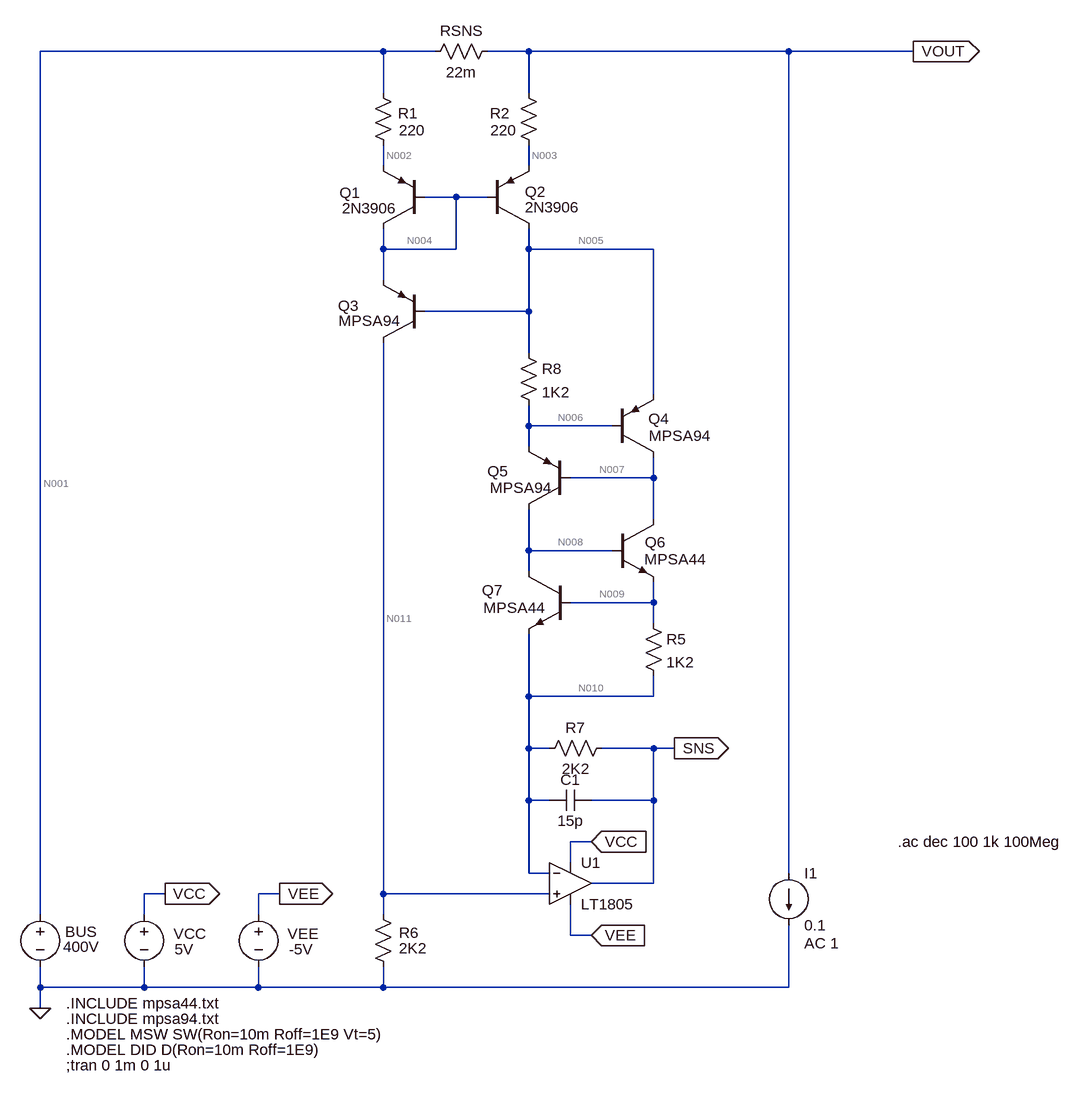
[diagram p0: schematic isense01_neg_rail_AC.asc]
* isense01_neg_rail_AC.asc
RSNS VOUT N001 22m
R1 N001 N002 220
R2 VOUT N003 220
Q1 N004 N004 N002 0 2N3906
Q2 N005 N004 N003 0 2N3906
R6 N011 0 2K2
R7 SNS N010 2K2
V§BUS N001 0 400V
Q7 N008 N009 N010 0 MPSA44
R8 N005 N006 1K2
R5 N009 N010 1K2
Q3 N011 N005 N004 0 MPSA94
VCC VCC 0 5V
C1 SNS N010 15p
Q5 N008 N007 N006 0 MPSA94
Q4 N007 N006 N005 0 MPSA94
Q6 N007 N008 N009 0 MPSA44
I1 VOUT 0 0.1 AC 1
VEE VEE 0 -5V
* U1: LT1805 (symbol Opamps\LT1805 not available, pins judged from their places): In+=N011 In-=N010 V+=VCC V-=VEE OUT=SNS
.model NPN NPN
.model PNP PNP
.lib standard.bjt
.MODEL MSW SW(Ron=10m Roff=1E9 Vt=5)
.MODEL DID D(Ron=10m Roff=1E9)
;tran 0 1m 0 1u
.INCLUDE mpsa44.txt
.INCLUDE mpsa94.txt
.ac dec 100 1k 100Meg
.backanno
.end

* Results of the author's LTspice run, read from the files saved beside the schematic
* Operating Point, zero values left out:
*   V(vout) = 400 V
*   V(n001) = 400 V
*   V(n002) = 399.8 V
*   V(n003) = 399.8 V
*   V(n004) = 399.1 V
*   V(n005) = 398.6 V
*   V(n011) = 2.194 V
*   V(sns) = 40.36 mV
*   V(n010) = 2.194 V
*   V(n008) = 3.306 V
*   V(n009) = 2.788 V
*   V(n006) = 398.1 V
*   V(vcc) = 5 V
*   V(n007) = 397.6 V
*   V(vee) = -5 V
*   Ic(Q4) = -501.4 µA
*   Ib(Q4) = -6.139 µA
*   Ie(Q4) = 507.6 µA
*   Ic(Q5) = -477.6 µA
*   Ib(Q5) = 265.3 nA
*   Ie(Q5) = 477.4 µA
*   Ic(Q3) = -997.1 µA
*   Ib(Q3) = 37.61 nA
*   Ie(Q3) = 997.1 µA
*   Ic(Q6) = 501.2 µA
*   Ib(Q6) = 354.4 nA
*   Ie(Q6) = -501.5 µA
*   Ic(Q7) = 477.3 µA
*   Ib(Q7) = 6.505 µA
*   Ie(Q7) = -483.8 µA
*   Ic(Q2) = -978.8 µA
*   Ib(Q2) = -4.882 µA
*   Ie(Q2) = 983.7 µA
*   Ic(Q1) = -987.3 µA
*   Ib(Q1) = -4.948 µA
*   Ie(Q1) = 992.2 µA
*   I(I1) = 100 mA
*   I(R5) = 495 µA
*   I(R8) = 471.2 µA
*   I(R7) = -978.9 µA
*   I(R6) = 997.2 µA
*   I(R2) = 983.7 µA
*   I(R1) = 992.2 µA
*   I(Rsns) = -101 mA
*   I(Vee) = 3.006 mA
*   I(Vcc) = -2.027 mA
*   I(Bus) = -102 mA
*   Ix(u1:1) = -124.7 nA
*   Ix(u1:2) = -124.7 nA
*   Ix(u1:3) = 978.9 µA
*   Ix(u1:4) = 2.027 mA
*   Ix(u1:5) = -3.006 mA
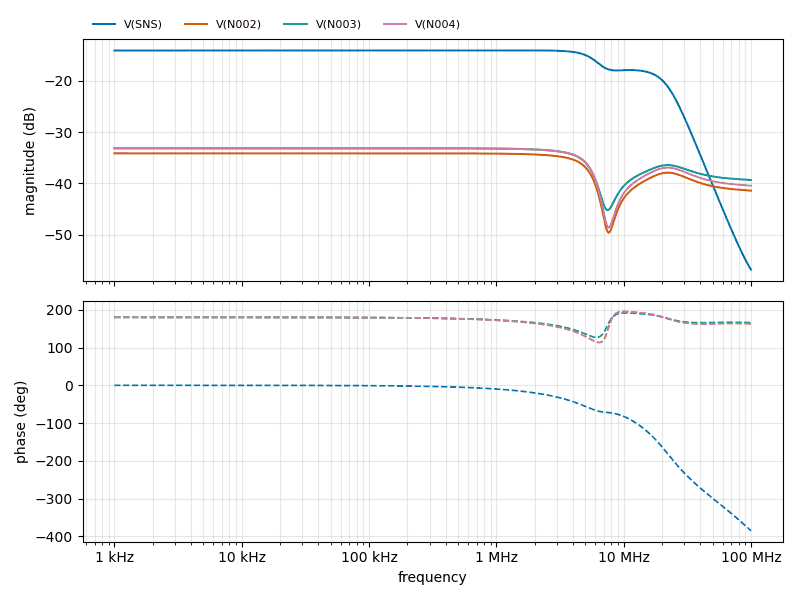
[diagram p1: AC Analysis of isense01_neg_rail_AC.asc, plotted from the saved traces]
* AC Analysis, 1 run:
*   V(SNS): -14.14 dB at 1 kHz, -56.77 dB at 100 MHz, peak -14.12 dB at 1.778 MHz, 3 dB below the peak at 6.73 MHz
*   V(N002): -34.14 dB at 1 kHz, -41.39 dB at 100 MHz, peak -34.14 dB at 1 kHz, 3 dB below the peak at 5.128 MHz
*   V(N003): -33.15 dB at 1 kHz, -39.32 dB at 100 MHz, peak -33.15 dB at 1 kHz, 3 dB below the peak at 5.102 MHz
*   V(N004): -33.16 dB at 1 kHz, -40.43 dB at 100 MHz, peak -33.16 dB at 1 kHz, 3 dB below the peak at 5.128 MHz